# Altium schematic sheet RGB-to-VGA.SchDoc: Iris
size A3; Organization: Toradex AG; Address1: Altsagenstrasse 5; Address2: Horw; Address3: 6048; Address4: Switzerland; DocumentNumber: 10; Revision: V2.0; SheetNumber: 10; SheetTotal: 16
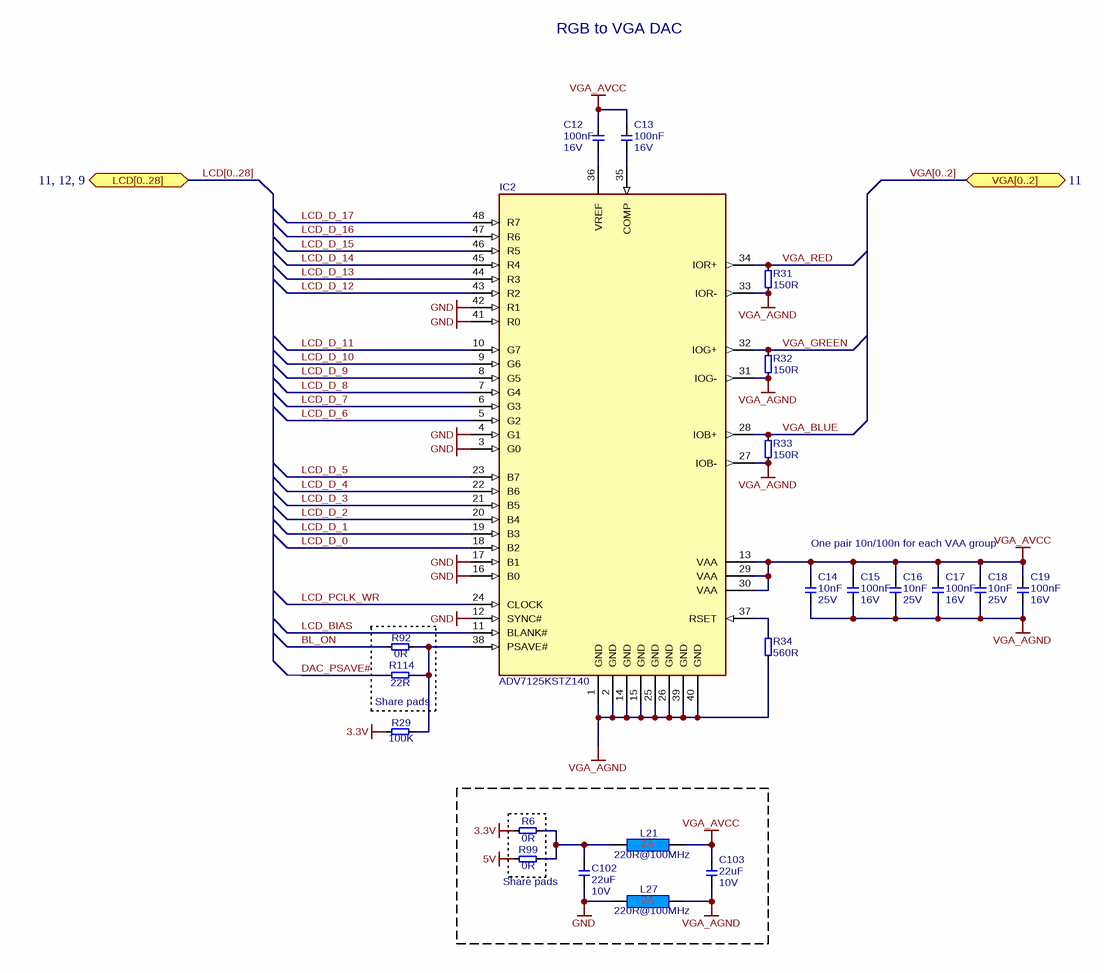
[diagram p0: RGB-to-VGA.SchDoc]

## Parts
C12  Rating: 16V  [CAPC1005X60N]  (hidden comment: 100nF)
C13  Rating: 16V  [CAPC1005X60N]  (hidden comment: 100nF)
C14  Rating: 25V  [CAPC1005X60N]  (hidden comment: 10nF)
C15  Rating: 16V  [CAPC1005X60N]  (hidden comment: 100nF)
C16  Rating: 25V  [CAPC1005X60N]  (hidden comment: 10nF)
C17  Rating: 16V  [CAPC1005X60N]  (hidden comment: 100nF)
C18  Rating: 25V  [CAPC1005X60N]  (hidden comment: 10nF)
C19  Rating: 16V  [CAPC1005X60N]  (hidden comment: 100nF)
C102  Rating: 10V  [T_CAPC0805X125N]  (hidden comment: 22uF)
C103  Rating: 10V  [T_CAPC0805X125N]  (hidden comment: 22uF)
IC2  ADV7125KSTZ140  [QFP50P900X900X120-48N]
L21  220R@100MHz  [INDC1608X95N]
L27  220R@100MHz  [INDC1608X95N]
R6  0R  [T_RESC0603X30N]
R29  100K  [T_RESC0603X30N]
R31  150R  [RESC1005X40N]
R32  150R  [RESC1005X40N]
R33  150R  [RESC1005X40N]
R34  560R  [RESC1005X40N]
R92  0R  [T_RESC0603X30N]
R99  0R  [T_RESC0603X30N]
R114  22R  [T_RESC0603X30N]

## Blocks framed on the sheet
Share pads: R92 R114
Share pads: C102 C103 L21 L27 R6 R99

## Ports
LCD[0..28] (bidir, see 11, 12, 9), VGA[0..2] (bidir, see 11)

## Nets
3.3V: R6.1 R29.1
5V: R99.1
GND: C102.1 IC2.3(G0) IC2.4(G1) IC2.12(SYNC#) IC2.16(B0) IC2.17(B1) IC2.41(R0) IC2.42(R1) L27.1
VGA_AGND: C14.1 C15.1 C16.1 C17.1 C18.1 C19.1 C103.1 IC2.1(GND) IC2.2(GND) IC2.14(GND) IC2.15(GND) IC2.25(GND) IC2.26(GND) IC2.27(IOB-) IC2.31(IOG-) IC2.33(IOR-) IC2.39(GND) IC2.40(GND) L27.2 R31.1 R32.1 R33.1 R34.1
VGA_AVCC: C12.2 C13.2 C14.2 C15.2 C16.2 C17.2 C18.2 C19.2 C103.2 IC2.13(VAA) IC2.29(VAA) IC2.30(VAA) L21.2
BL_ON: R92.1
DAC_PSAVE#: R114.1
LCD_BIAS: IC2.11(BLANK#)
LCD_D_0: IC2.18(B2)
LCD_D_1: IC2.19(B3)
LCD_D_2: IC2.20(B4)
LCD_D_3: IC2.21(B5)
LCD_D_4: IC2.22(B6)
LCD_D_5: IC2.23(B7)
LCD_D_6: IC2.5(G2)
LCD_D_7: IC2.6(G3)
LCD_D_8: IC2.7(G4)
LCD_D_9: IC2.8(G5)
LCD_D_10: IC2.9(G6)
LCD_D_11: IC2.10(G7)
LCD_D_12: IC2.43(R2)
LCD_D_13: IC2.44(R3)
LCD_D_14: IC2.45(R4)
LCD_D_15: IC2.46(R5)
LCD_D_16: IC2.47(R6)
LCD_D_17: IC2.48(R7)
LCD_PCLK_WR: IC2.24(CLOCK)
VGA_BLUE: IC2.28(IOB+) R33.2
VGA_GREEN: IC2.32(IOG+) R32.2
VGA_RED: IC2.34(IOR+) R31.2
NetC12_1: C12.1 IC2.36(VREF)
NetC13_1: C13.1 IC2.35(COMP)
NetC102_2: C102.2 L21.1 R6.2 R99.2
NetIC2_37: IC2.37(RSET) R34.2
NetIC2_38: IC2.38(PSAVE#) R29.2 R92.2 R114.2

## Buses and harness runs
bus LCD[0..28] = port LCD[0..28]
bus VGA[0..2] = port VGA[0..2]

## Notes on the sheet
- RGB to VGA DAC
- One pair 10n/100n for each VAA group
- Title
- Size:
- Date:
- A3
- Number:
- Time:
- Revision:
- Sheet
- of
- File:

## Library data of the parts
C12 C13 C15 C17 C19 = C-X7R-100nF-16V-10%-0402: Capacitor Ceramic X7R 100nF 16V 10% 0402; Tolerance: 10%; Type: X7R; Value: 100nF
C14 C16 C18 = C-X7R-10nF-25V-10%-0402: Capacitor Ceramic X7R 10nF 25V 10% 0402; Tolerance: 10%; Type: X7R; Value: 10nF
C102 C103 = C-X5R-22uF-10V-20%-0805: Capacitor Ceramic X5R 22uF 10V 20% 0805; Tolerance: 20%; Type: X5R; Value: 22uF
IC2 = IC-AD-ADV7125KSTZ140: Video DAC 8bit 140MHz; Manufacturer Name: Analog Devices; Manufacturer Part No.: ADV7125KSTZ140
L21 L27 = L-220R@100MHz-2A-25%-0603: 220R@100MHz 2A EMI FILTER; Tolerance: 25%; Rating: 2A; Value: 220R@100MHz
R6 R92 R99 = R-0R-63mW-5%-0603: Resistor 0 ohm 63mW 5% 0603; Rating: 63mW; Tolerance: 5%; Value: 0R; Size: 0603 (In)
R29 = R-100KR-63mW-5%-0603: Resistor 100 Kohm 63mW 5% 0603; Value: 100KR; Rating: 63mW; Tolerance: 5%
R31-R33 = R-150R-63mW-5%-0402: Resistor 150 ohm 63mW 5% 0402; Rating: 63mW; Tolerance: 5%; Value: 150R
R34 = R-560R-63mW-5%-0402: Resistor 560 ohm 63mW 5% 0402; Rating: 63mW; Tolerance: 5%; Value: 560R
R114 = R-22R-63mW-5%-0603: Resistor 22 ohm 63mW 5% 0603; Rating: 63mW; Tolerance: 5%; Value: 22R